# Altium schematic sheet homepage.SchDoc: TemperatureController
size A3; Author: wq; DrawnBy: wq; Organization: 合肥弗雷电子; Address1: 玉兰大道14号D栋3楼; Address2: 肥西县桃花镇; Address3: 合肥市; Address4: 安徽省; DocumentNumber: 1; Revision: betaV1.0; SheetNumber: 1; SheetTotal: 8
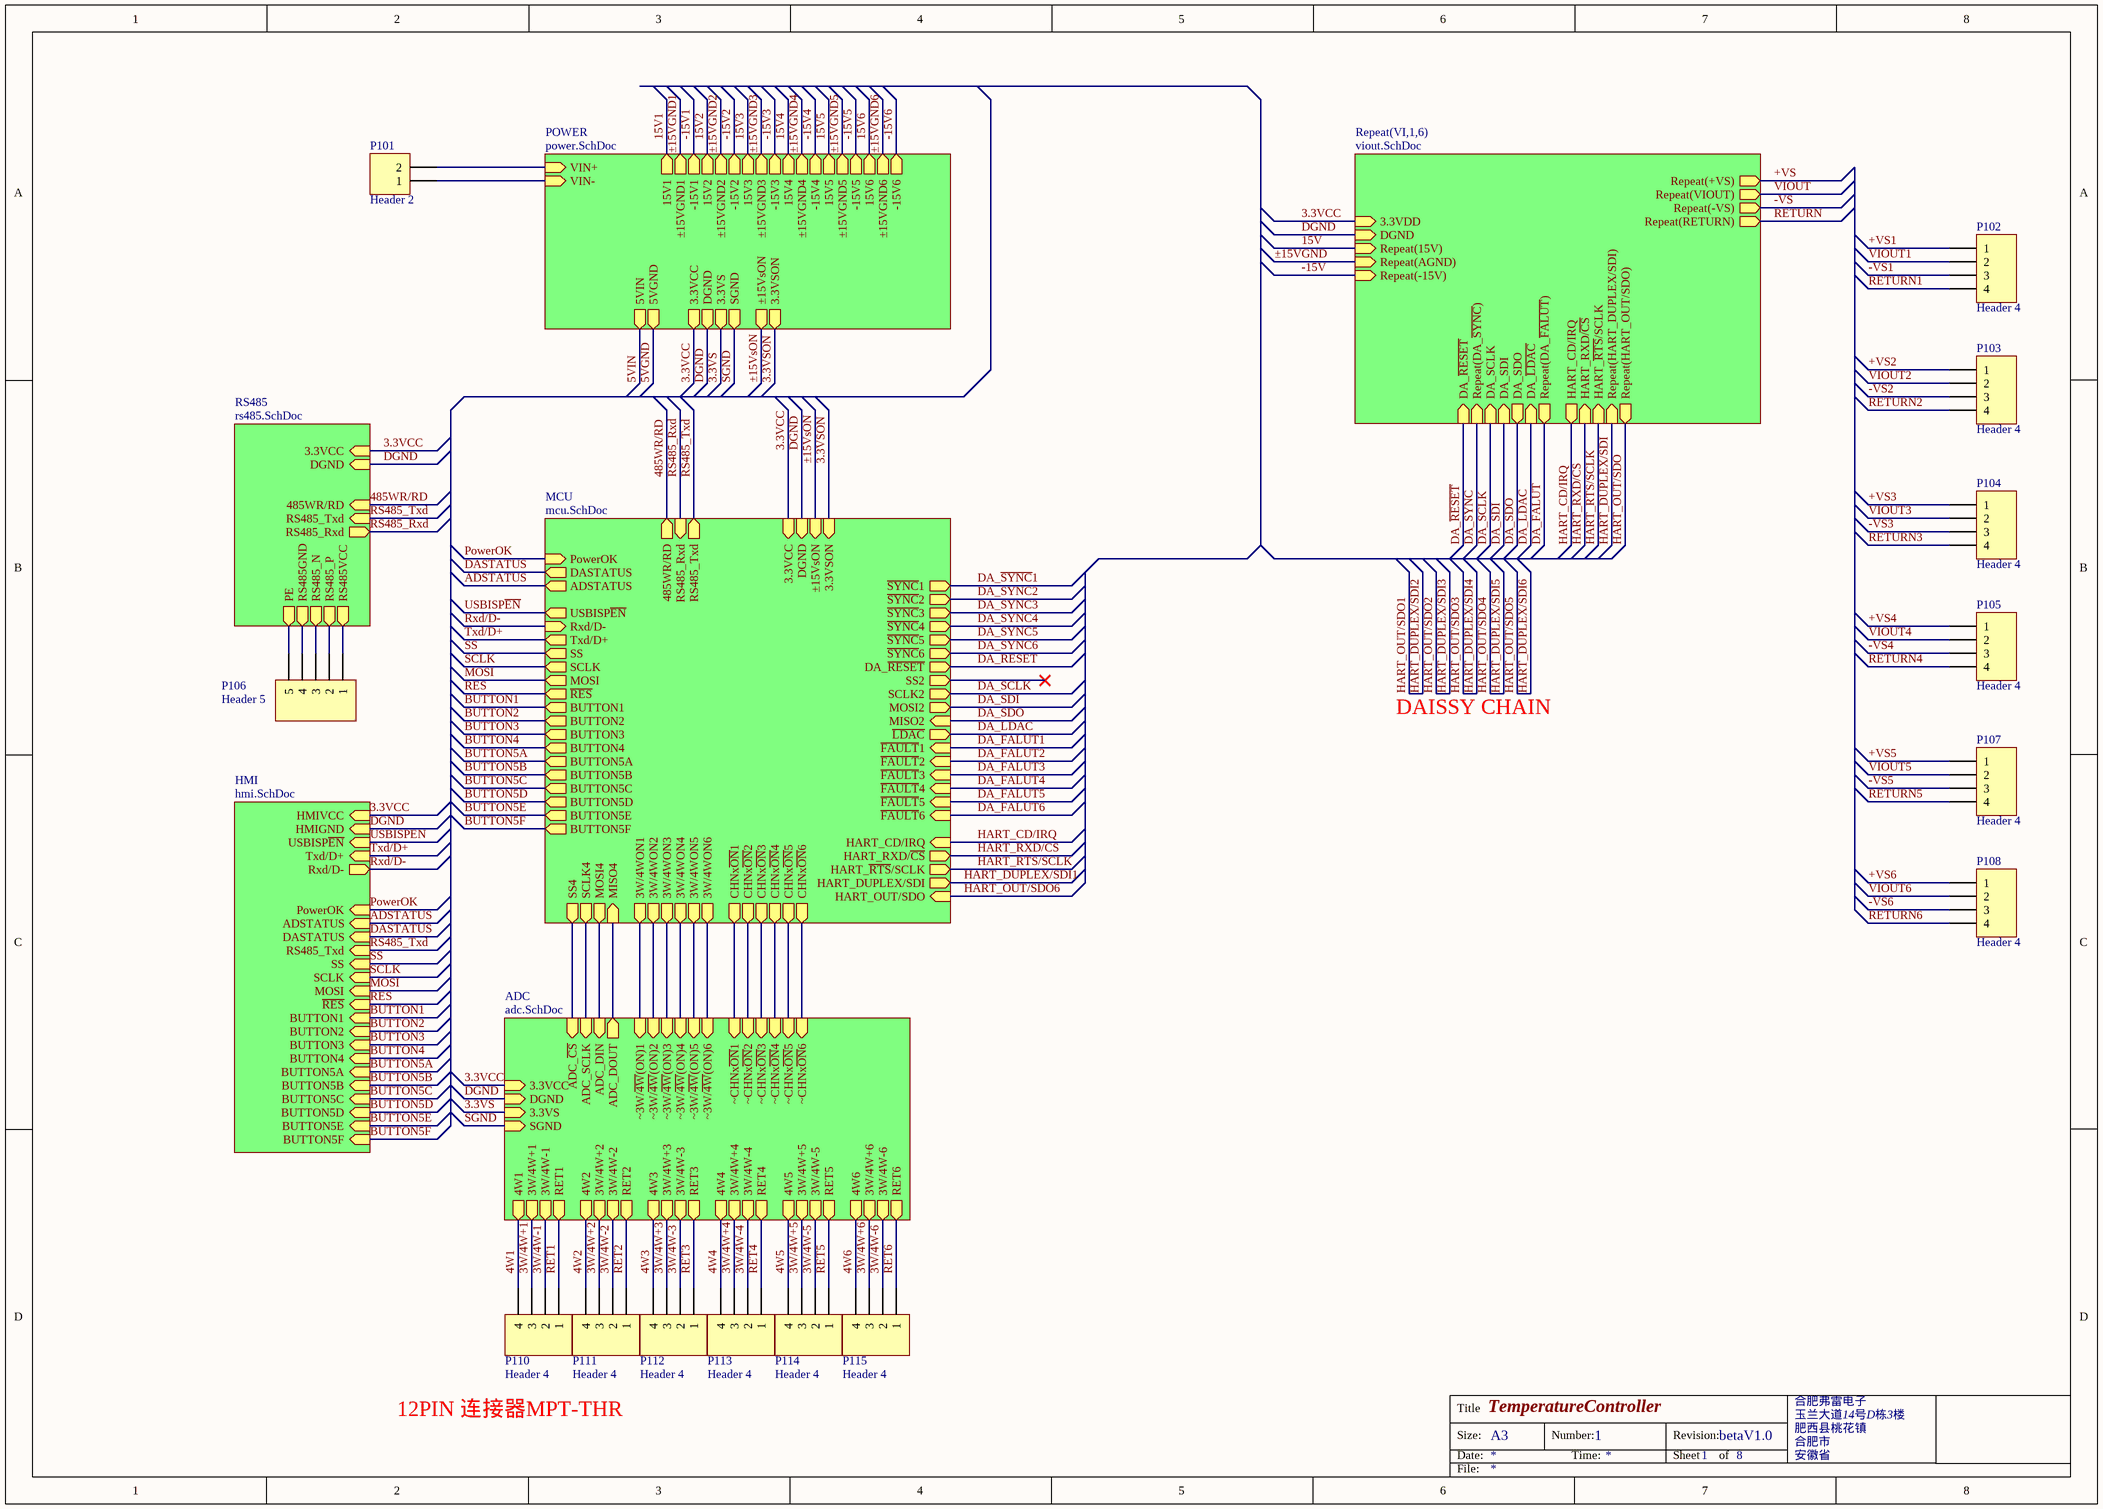
[diagram p0: homepage.SchDoc]

## Parts
P101  Header 2  [HDR1X2]
P102  Header 4  [HDR1X4]
P103  Header 4  [HDR1X4]
P104  Header 4  [HDR1X4]
P105  Header 4  [HDR1X4]
P106  Header 5  [HDR1X5]
P107  Header 4  [HDR1X4]
P108  Header 4  [HDR1X4]
P110  Header 4  [HDR1X4]
P111  Header 4  [HDR1X4]
P112  Header 4  [HDR1X4]
P113  Header 4  [HDR1X4]
P114  Header 4  [HDR1X4]
P115  Header 4  [HDR1X4]

## Sub-sheets
ADC = adc.SchDoc: 4W1 (out), 4W2 (out), 4W3 (out), 4W4 (out), 4W5 (out), 4W6 (out), 3W/4W+1 (out), 3W/4W+2 (out), 3W/4W+3 (out), 3W/4W+4 (out), 3W/4W+5 (out), 3W/4W+6 (out), 3W/4W-1 (out), 3W/4W-2 (out), 3W/4W-3 (out), 3W/4W-4 (out), 3W/4W-5 (out), 3W/4W-6 (out), RET1 (out), RET2 (out), RET3 (out), RET4 (out), RET5 (out), RET6 (out), ~CHNx~{ON}1 (in), ~CHNx~{ON}2 (in), ~CHNx~{ON}3 (in), ~CHNx~{ON}4 (in), ~CHNx~{ON}5 (in), ~CHNx~{ON}6 (in), ~3W/~{4W}(ON)1 (in), ~3W/~{4W}(ON)2 (in), ~3W/~{4W}(ON)3 (in), ~3W/~{4W}(ON)4 (in), ~3W/~{4W}(ON)5 (in), ~3W/~{4W}(ON)6 (in), 3.3VS (in), SGND (in), 3.3VCC (in), DGND (in), ADC_SCLK (in), ADC_~{CS} (in), ADC_DIN (in), ADC_DOUT (out)
HMI = hmi.SchDoc: HMIVCC (in), HMIGND (in), PowerOK (in), BUTTON1 (in), BUTTON2 (in), BUTTON3 (in), BUTTON4 (in), BUTTON5A (in), SS (in), SCLK (in), BUTTON5B (in), BUTTON5C (in), BUTTON5D (in), BUTTON5E (in), BUTTON5F (in), USBISP~{EN} (in), Rxd/D- (out), Txd/D+ (in), ADSTATUS (in), DASTATUS (in), RS485_Txd (in), MOSI (in), ~{RES} (in)
MCU = mcu.SchDoc: Txd/D+ (out), Rxd/D- (in), 3.3VCC (in), DGND (in), MOSI4 (out), MISO4 (in), SCLK4 (out), SS4 (out), ±15VsON (in), BUTTON5A (out), 3W/4WON1 (out), 3W/4WON2 (out), 3W/4WON3 (out), 3W/4WON4 (out), 3W/4WON5 (out), 3W/4WON6 (out), 3.3VSON (in), PowerOK (in), MOSI2 (out), MISO2 (in), SCLK2 (out), SS2 (out), BUTTON1 (out), BUTTON2 (out), BUTTON3 (out), BUTTON4 (out), CHNx~{ON}1 (out), RS485_Txd (out), RS485_Rxd (in), 485WR/RD (out), SCLK (out), ~{RES} (out), DASTATUS (out), ADSTATUS (out), ~{SYNC}1 (out), ~{SYNC}2 (out), ~{SYNC}3 (out), ~{SYNC}4 (out), ~{SYNC}5 (out), ~{SYNC}6 (out), CHNx~{ON}2 (out), CHNx~{ON}3 (out), DA_~{RESET} (out), ~{LDAC} (out), HART_RXD/~{CS} (out), HART_~{RTS}/SCLK (out), HART_DUPLEX/SDI (out), HART_OUT/SDO (in), HART_CD/IRQ (in), BUTTON5D (out), CHNx~{ON}6 (out), BUTTON5F (out), BUTTON5C (out), BUTTON5E (out), CHNx~{ON}5 (out), CHNx~{ON}4 (out), BUTTON5B (out), ~{FAULT}3 (in), ~{FAULT}4 (in), ~{FAULT}2 (in), ~{FAULT}1 (in), ~{FAULT}5 (in), ~{FAULT}6 (in), USBISP~{EN} (out), MOSI (out), SS (out)
POWER = power.SchDoc: ±15VsON (out), 3.3VSON (out), VIN+ (in), VIN- (in), 3.3VCC (out), DGND (out), 3.3VS (out), SGND (out), 15V6 (out), ±15VGND2 (out), -15V6 (out), ±15VGND1 (out), ±15VGND4 (out), ±15VGND5 (out), 15V4 (out), -15V2 (out), -15V3 (out), 15V5 (out), -15V5 (out), -15V1 (out), ±15VGND6 (out), 15V3 (out), -15V4 (out), ±15VGND3 (out), 15V1 (out), 15V2 (out), 5VIN (out), 5VGND (out)
Repeat(VI,1,6) = viout.SchDoc: Repeat(DA_~{SYNC}) (in), DA_SCLK (in), DA_SDI (in), DA_~{LDAC} (in), DA_SDO (out), Repeat(DA_~{FALUT}) (out), DA_~{RESET} (in), HART_RXD/~{CS} (in), HART_~{RTS}/SCLK (in), Repeat(HART_DUPLEX/SDI) (in), Repeat(HART_OUT/SDO) (out), HART_CD/IRQ (out), 3.3VDD (in), DGND (in), Repeat(VIOUT) (out), Repeat(+VS) (out), Repeat(-VS) (out), Repeat(15V) (in), Repeat(AGND) (in), Repeat(-15V) (in), Repeat(RETURN) (out)
RS485 = rs485.SchDoc: 3.3VCC (in), DGND (in), RS485_Txd (in), RS485_Rxd (out), 485WR/RD (in), RS485_P (out), RS485_N (out), PE (out), RS485VCC (out), RS485GND (out)

## Nets
3.3VCC: sheet MCU/3.3VCC, sheet POWER/3.3VCC, sheet RS485/3.3VCC, sheet ADC/3.3VCC, sheet Repeat(VI,1,6)/3.3VDD, sheet HMI/HMIVCC
3.3VS: sheet POWER/3.3VS, sheet ADC/3.3VS
3.3VSON: sheet MCU/3.3VSON, sheet POWER/3.3VSON
3W/4W+1: P110.3 ; sheet ADC/3W/4W+1
3W/4W+2: P111.3 ; sheet ADC/3W/4W+2
3W/4W+3: P112.3 ; sheet ADC/3W/4W+3
3W/4W+4: P113.3 ; sheet ADC/3W/4W+4
3W/4W+5: P114.3 ; sheet ADC/3W/4W+5
3W/4W+6: P115.3 ; sheet ADC/3W/4W+6
3W/4W-1: P110.2 ; sheet ADC/3W/4W-1
3W/4W-2: P111.2 ; sheet ADC/3W/4W-2
3W/4W-3: P112.2 ; sheet ADC/3W/4W-3
3W/4W-4: P113.2 ; sheet ADC/3W/4W-4
3W/4W-5: P114.2 ; sheet ADC/3W/4W-5
3W/4W-6: P115.2 ; sheet ADC/3W/4W-6
4W1: P110.4 ; sheet ADC/4W1
4W2: P111.4 ; sheet ADC/4W2
4W3: P112.4 ; sheet ADC/4W3
4W4: P113.4 ; sheet ADC/4W4
4W5: P114.4 ; sheet ADC/4W5
4W6: P115.4 ; sheet ADC/4W6
5VGND: sheet POWER/5VGND
5VIN: sheet POWER/5VIN
15V: sheet Repeat(VI,1,6)/Repeat(15V)
15V1: sheet POWER/15V1
15V2: sheet POWER/15V2
15V3: sheet POWER/15V3
15V4: sheet POWER/15V4
15V5: sheet POWER/15V5
15V6: sheet POWER/15V6
485WR/RD: sheet MCU/485WR/RD, sheet RS485/485WR/RD
+VS: sheet Repeat(VI,1,6)/Repeat(+VS)
+VS1: P102.1
+VS2: P103.1
+VS3: P104.1
+VS4: P105.1
+VS5: P107.1
+VS6: P108.1
-15V: sheet Repeat(VI,1,6)/Repeat(-15V)
-15V1: sheet POWER/-15V1
-15V2: sheet POWER/-15V2
-15V3: sheet POWER/-15V3
-15V4: sheet POWER/-15V4
-15V5: sheet POWER/-15V5
-15V6: sheet POWER/-15V6
-VS: sheet Repeat(VI,1,6)/Repeat(-VS)
-VS1: P102.3
-VS2: P103.3
-VS3: P104.3
-VS4: P105.3
-VS5: P107.3
-VS6: P108.3
ADSTATUS: sheet MCU/ADSTATUS, sheet HMI/ADSTATUS
BUTTON1: sheet MCU/BUTTON1, sheet HMI/BUTTON1
BUTTON2: sheet MCU/BUTTON2, sheet HMI/BUTTON2
BUTTON3: sheet MCU/BUTTON3, sheet HMI/BUTTON3
BUTTON4: sheet MCU/BUTTON4, sheet HMI/BUTTON4
BUTTON5A: sheet MCU/BUTTON5A, sheet HMI/BUTTON5A
BUTTON5B: sheet MCU/BUTTON5B, sheet HMI/BUTTON5B
BUTTON5C: sheet MCU/BUTTON5C, sheet HMI/BUTTON5C
BUTTON5D: sheet MCU/BUTTON5D, sheet HMI/BUTTON5D
BUTTON5E: sheet MCU/BUTTON5E, sheet HMI/BUTTON5E
BUTTON5F: sheet MCU/BUTTON5F, sheet HMI/BUTTON5F
DA_~{FALUT}: sheet Repeat(VI,1,6)/Repeat(DA_~{FALUT})
DA_~{FALUT}1: sheet MCU/~{FAULT}1
DA_~{FALUT}2: sheet MCU/~{FAULT}2
DA_~{FALUT}3: sheet MCU/~{FAULT}3
DA_~{FALUT}4: sheet MCU/~{FAULT}4
DA_~{FALUT}5: sheet MCU/~{FAULT}5
DA_~{FALUT}6: sheet MCU/~{FAULT}6
DA_~{LDAC}: sheet MCU/~{LDAC}, sheet Repeat(VI,1,6)/DA_~{LDAC}
DA_~{RESET}: sheet MCU/DA_~{RESET}, sheet Repeat(VI,1,6)/DA_~{RESET}
DA_~{SYNC}: sheet Repeat(VI,1,6)/Repeat(DA_~{SYNC})
DA_~{SYNC}1: sheet MCU/~{SYNC}1
DA_~{SYNC}2: sheet MCU/~{SYNC}2
DA_~{SYNC}3: sheet MCU/~{SYNC}3
DA_~{SYNC}4: sheet MCU/~{SYNC}4
DA_~{SYNC}5: sheet MCU/~{SYNC}5
DA_~{SYNC}6: sheet MCU/~{SYNC}6
DA_SCLK: sheet MCU/SCLK2, sheet Repeat(VI,1,6)/DA_SCLK
DA_SDI: sheet MCU/MOSI2, sheet Repeat(VI,1,6)/DA_SDI
DA_SDO: sheet MCU/MISO2, sheet Repeat(VI,1,6)/DA_SDO
DASTATUS: sheet MCU/DASTATUS, sheet HMI/DASTATUS
DGND: sheet MCU/DGND, sheet POWER/DGND, sheet RS485/DGND, sheet ADC/DGND, sheet Repeat(VI,1,6)/DGND, sheet HMI/HMIGND
HART_CD/IRQ: sheet MCU/HART_CD/IRQ, sheet Repeat(VI,1,6)/HART_CD/IRQ
HART_DUPLEX/SDI: sheet Repeat(VI,1,6)/Repeat(HART_DUPLEX/SDI)
HART_DUPLEX/SDI1: sheet MCU/HART_DUPLEX/SDI
HART_OUT/SDO: sheet Repeat(VI,1,6)/Repeat(HART_OUT/SDO)
HART_OUT/SDO6: sheet MCU/HART_OUT/SDO
HART_~{RTS}/SCLK: sheet MCU/HART_~{RTS}/SCLK, sheet Repeat(VI,1,6)/HART_~{RTS}/SCLK
HART_RXD/~{CS}: sheet MCU/HART_RXD/~{CS}, sheet Repeat(VI,1,6)/HART_RXD/~{CS}
MOSI: sheet MCU/MOSI, sheet HMI/MOSI
PowerOK: sheet MCU/PowerOK, sheet HMI/PowerOK
~{RES}: sheet MCU/~{RES}, sheet HMI/~{RES}
RET1: P110.1 ; sheet ADC/RET1
RET2: P111.1 ; sheet ADC/RET2
RET3: P112.1 ; sheet ADC/RET3
RET4: P113.1 ; sheet ADC/RET4
RET5: P114.1 ; sheet ADC/RET5
RET6: P115.1 ; sheet ADC/RET6
RETURN: sheet Repeat(VI,1,6)/Repeat(RETURN)
RETURN1: P102.4
RETURN2: P103.4
RETURN3: P104.4
RETURN4: P105.4
RETURN5: P107.4
RETURN6: P108.4
RS485_Rxd: sheet MCU/RS485_Rxd, sheet RS485/RS485_Rxd
RS485_Txd: sheet MCU/RS485_Txd, sheet RS485/RS485_Txd, sheet HMI/RS485_Txd
Rxd/D-: sheet MCU/Rxd/D-, sheet HMI/Rxd/D-
SCLK: sheet MCU/SCLK, sheet HMI/SCLK
SGND: sheet POWER/SGND, sheet ADC/SGND
SS: sheet MCU/SS, sheet HMI/SS
Txd/D+: sheet MCU/Txd/D+, sheet HMI/Txd/D+
USBISP~{EN}: sheet MCU/USBISP~{EN}, sheet HMI/USBISP~{EN}
VIOUT: sheet Repeat(VI,1,6)/Repeat(VIOUT)
VIOUT1: P102.2
VIOUT2: P103.2
VIOUT3: P104.2
VIOUT4: P105.2
VIOUT5: P107.2
VIOUT6: P108.2
±15VGND: sheet Repeat(VI,1,6)/Repeat(AGND)
±15VGND1: sheet POWER/±15VGND1
±15VGND2: sheet POWER/±15VGND2
±15VGND3: sheet POWER/±15VGND3
±15VGND4: sheet POWER/±15VGND4
±15VGND5: sheet POWER/±15VGND5
±15VGND6: sheet POWER/±15VGND6
±15VsON: sheet MCU/±15VsON, sheet POWER/±15VsON
NetP101_1: P101.1 ; sheet POWER/VIN-
NetP101_2: P101.2 ; sheet POWER/VIN+
NetP106_1: P106.1 ; sheet RS485/RS485VCC
NetP106_2: P106.2 ; sheet RS485/RS485_P
NetP106_3: P106.3 ; sheet RS485/RS485_N
NetP106_4: P106.4 ; sheet RS485/RS485GND
NetP106_5: P106.5 ; sheet RS485/PE
(unnamed): sheet MCU/MOSI4, sheet ADC/ADC_DIN
(unnamed): sheet MCU/MISO4, sheet ADC/ADC_DOUT
(unnamed): sheet MCU/SCLK4, sheet ADC/ADC_SCLK
(unnamed): sheet MCU/SS4, sheet ADC/ADC_~{CS}
(unnamed): sheet MCU/3W/4WON1, sheet ADC/~3W/~{4W}(ON)1
(unnamed): sheet MCU/3W/4WON2, sheet ADC/~3W/~{4W}(ON)2
(unnamed): sheet MCU/3W/4WON3, sheet ADC/~3W/~{4W}(ON)3
(unnamed): sheet MCU/3W/4WON4, sheet ADC/~3W/~{4W}(ON)4
(unnamed): sheet MCU/3W/4WON5, sheet ADC/~3W/~{4W}(ON)5
(unnamed): sheet MCU/3W/4WON6, sheet ADC/~3W/~{4W}(ON)6
(unnamed): sheet MCU/CHNx~{ON}1, sheet ADC/~CHNx~{ON}1
(unnamed): sheet MCU/CHNx~{ON}2, sheet ADC/~CHNx~{ON}2
(unnamed): sheet MCU/CHNx~{ON}3, sheet ADC/~CHNx~{ON}3
(unnamed): sheet MCU/CHNx~{ON}6, sheet ADC/~CHNx~{ON}6
(unnamed): sheet MCU/CHNx~{ON}5, sheet ADC/~CHNx~{ON}5
(unnamed): sheet MCU/CHNx~{ON}4, sheet ADC/~CHNx~{ON}4

## Notes on the sheet
- DAISSY CHAIN
- 12PIN 连接器MPT-THR
- Title
- Size:
- Date:
- A3
- Number:
- Time:
- Revision:
- Sheet
- of
- File:

## Library data of the parts
P101 = Header 2: Header, 2-Pin; LatestRevisionDate: 17-Jul-2002; LatestRevisionNote: Re-released for DXP Platform.; Publisher: Altium Limited
P102-P105 P107 P108 P110-P115 = Header 4: Header, 4-Pin; LatestRevisionDate: 17-Jul-2002; LatestRevisionNote: Re-released for DXP Platform.; Publisher: Altium Limited
P106 = Header 5: Header, 5-Pin; LatestRevisionDate: 17-Jul-2002; LatestRevisionNote: Re-released for DXP Platform.; Publisher: Altium Limited